# EAGLE design SparkFun_LilyPad-Switched-Battery (EAGLE 9.6.2)
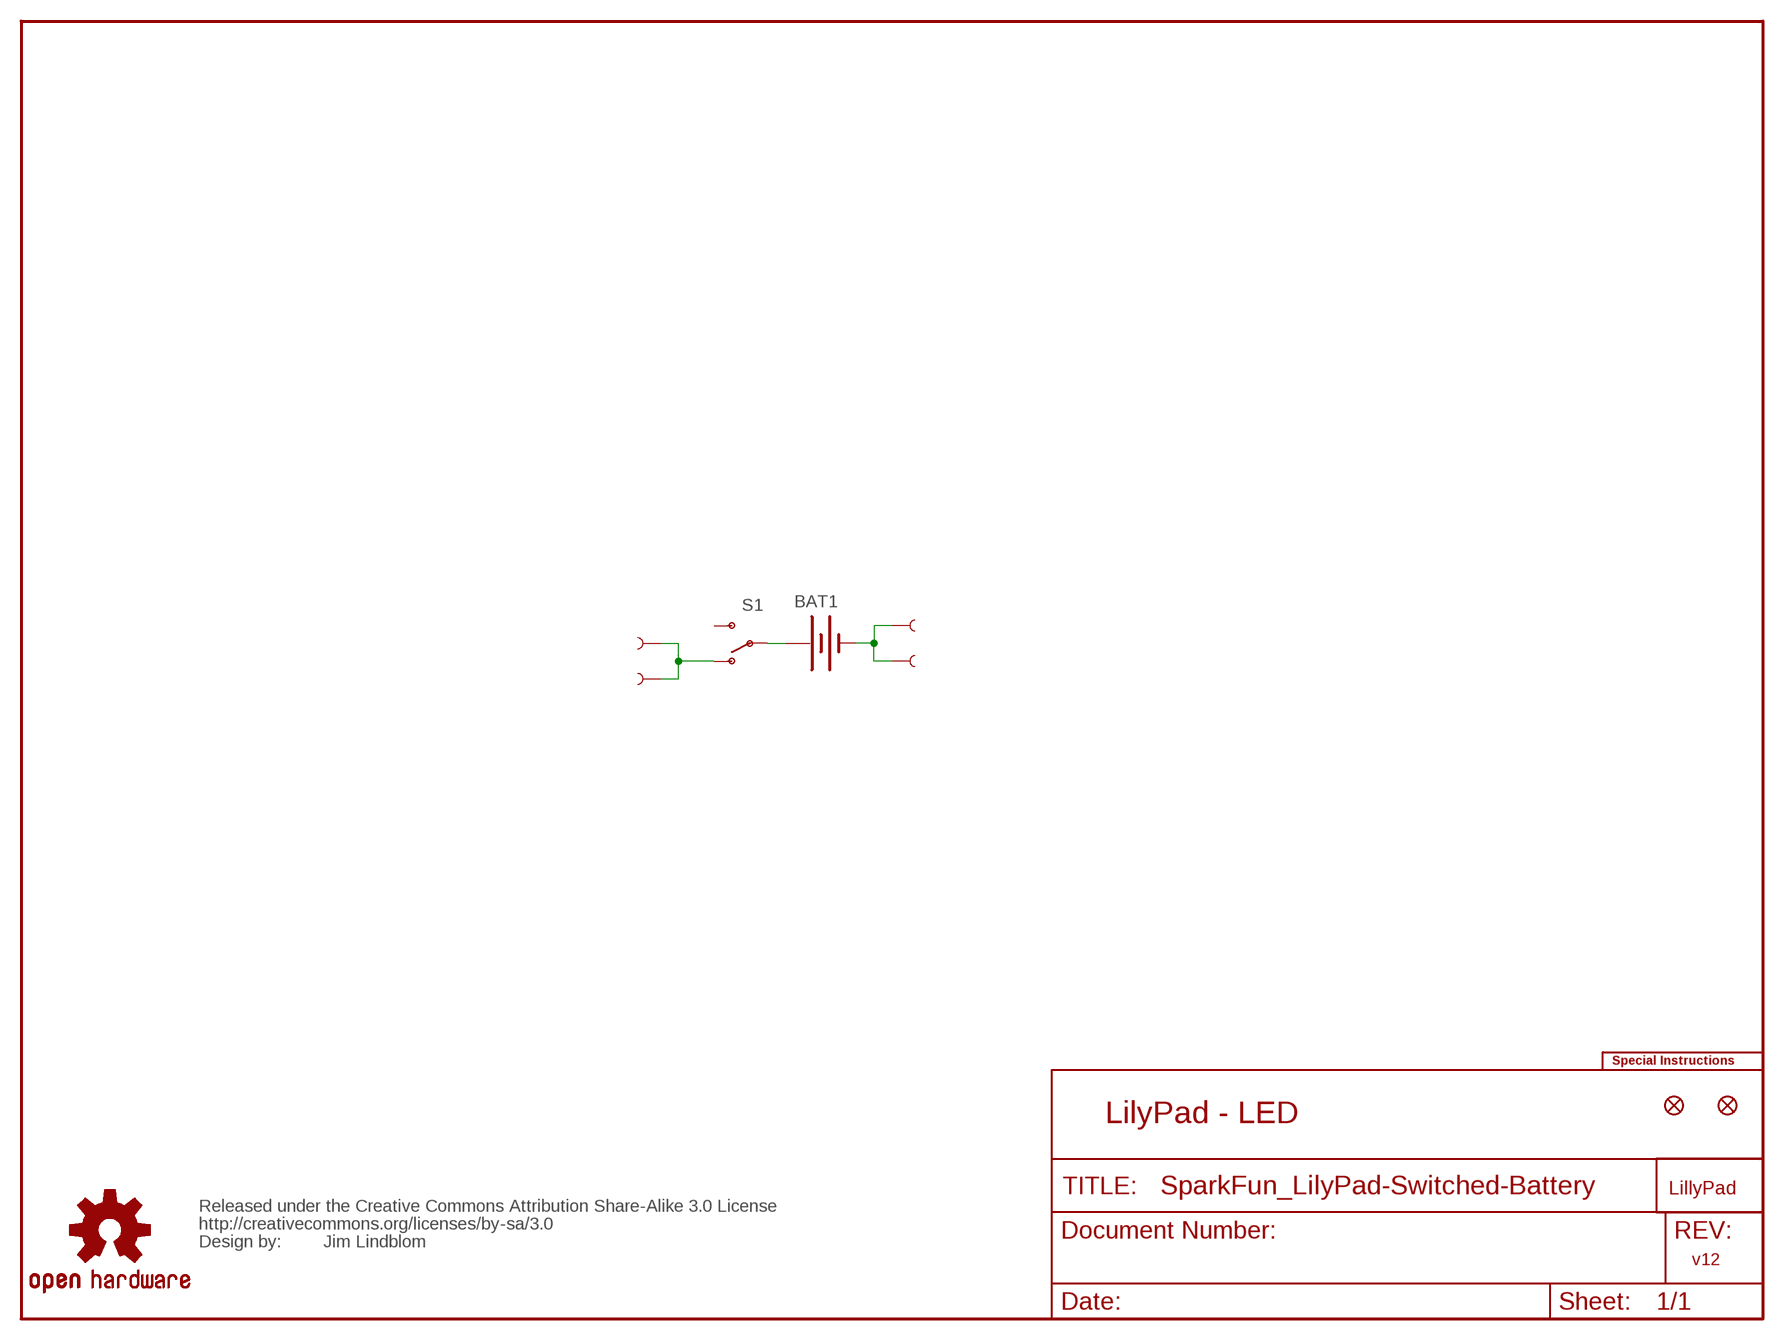
[diagram p0: schematic, sheet 1]

## Parts
BAT1  BATTERY20MM_4LEGS  [BATTCON_20MM_4LEGS]
JP1  FIDUCIALUFIDUCIAL  [MICRO-FIDUCIAL]
JP2  FIDUCIALUFIDUCIAL  [MICRO-FIDUCIAL]
LOGO1  SPECIAL_INSTRUCTIONS-ORDERING  [ORDERING_INSTRUCTIONS]
S1  SWITCH-SPSTSMD  [AYZ0202]
U$1  SEWTAP6  [PETAL-SMALL-2SIDE]
U$2  SEWTAP6  [PETAL-SMALL-2SIDE]
U$3  SEWTAP6  [PETAL-SMALL-2SIDE]
U$4  SEWTAP6  [PETAL-SMALL-2SIDE]
U$5  LOGO-LPLP  [LOGO-LILYPAD]
U$7  OSHW-LOGOS  [OSHW-LOGO-S]
U$8  CREATIVE_COMMONS  [CREATIVE_COMMONS]

## Nets
N$1: S1.1(O) U$2.1 U$4.1
N$2: BAT1.2(-) U$1.1 U$3.1
N$3: BAT1.1(+) BAT1.3(+) BAT1.P$1(+) BAT1.P$2(+) S1.2(P)
Unconnected: S1.3(S)

## Notes on the sheet
- LilyPad - LED
- Jim Lindblom
- v12

## Library data of the parts
BAT1 = SparkFun-Electromechanical:BATTERY: Battery Holders Various common sizes : AA, AAA, 20mm coin cell and 12mm coin cell.
JP1 JP2 = SparkFun:FIDUCIAL: Fiducial Alignment Points Various fiducial points for machine vision alignment.
LOGO1 = SparkFun-Aesthetics:SPECIAL_INSTRUCTIONS: Special Ordering/Production Instructions Alert Symbol for special PCB ordering instructions or unique production process warnings. Ordering Instructions Production Instructions Types of information that should be added to box: Copper weight Soldermask color Silk color PCB thickness Number of layers PCB Standard: 1.6mm FR4 1 oz copper immersion silver plating red soldermask white silkscreen Types of information that should be added to box: Special wash requirements Depaneling instructions Humidification Glue curing Default text settings: 0.07 inch 9% ratio 50% line distance
S1 = SparkFun:SWITCH-SPST: SPST Switch Simple slide switch. Spark Fun Electronics SKU : COM-00102
U$1-U$4 = LilyPad-Wearables:SEWTAP
U$5 = LilyPad-Wearables:LOGO-LP
U$7 = SparkFun-Aesthetics:OSHW-LOGO: Open Source Hardware Logo This logo indicates the piece of hardware it is found on incorporates a OSHW license and/or adheres to the definition of open source hardware found here: http://freedomdefined.org/OSHW
U$8 = SparkFun-Aesthetics:CREATIVE_COMMONS: Creative Commons License summary

## Board
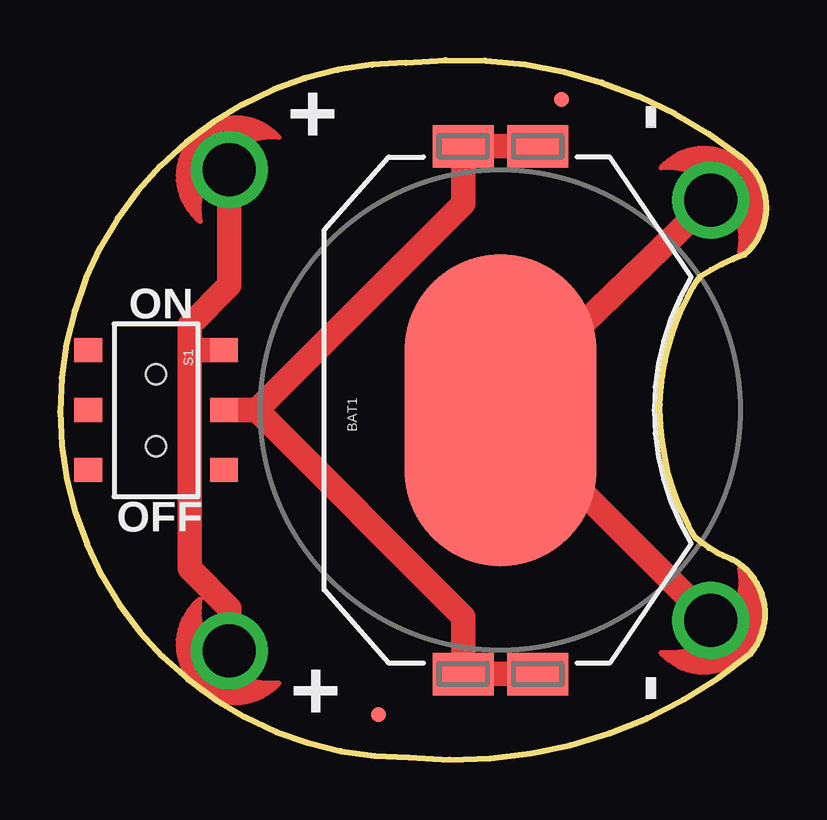
[diagram p1: board, top side]
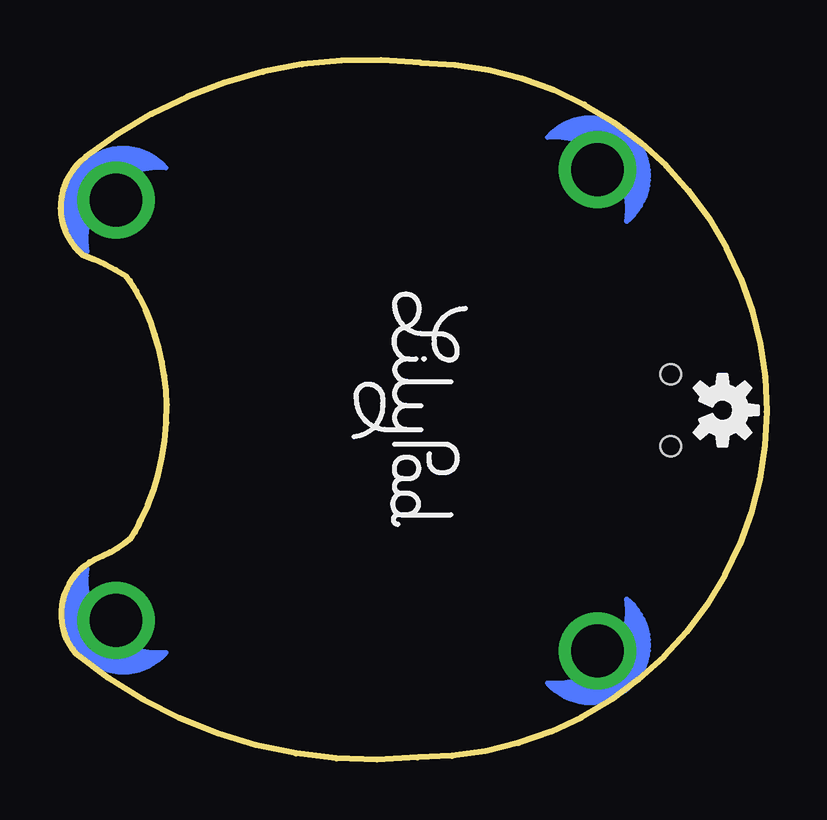
[diagram p2: board, bottom side, seen from below]

Size 29.42 x 29.17 mm. Coordinates in mm from the lower left corner, seen from the top.
Outline: 14.54,0.09 arc45 28.77,4.41 arc103 28,8.35 arc-20 26.48,9.25 arc-11 26.07,9.99 arc-17 25.21,12.55 arc-11 24.99,14.8 arc-13 25.34,17.17 arc-9 25.88,18.76 26.15,19.29 arc-14 26.7,20.16 arc-13 28.51,21.05 arc102 28.38,25.11 arc45 14.41,29.05 arc180 14.54,0.09
Copper layers (1*16): Top 0.035mm / dielectric 1.5mm / Bottom 0.035mm
Design rules "default": minimum track width 8mil, minimum drill 20mil, track to track 8mil, track to pad 8mil, pad to pad 8mil, via to via 8mil, smd to smd 8mil, copper to edge 8mil, drill to drill 8mil, minimum pad ring 12mil, minimum via ring 10mil, stop-mask expansion 4mil, vias tented up to drill 20mil, thermal gap 10mil

### Footprints (pad centres in the part's own frame; a part is rotated, then mirrored left to right if it is on the bottom)
BATTCON_20MM_4LEGS = smd 1.778 x 2.54: 1 -11,1.55; 3 11,1.55; P$1 -11,-1.55; P$2 11,-1.55 | smd 13 x 8: 2 0,0
MICRO-FIDUCIAL = smd 0.635 x 0.635: 1 0,0
AYZ0202 = smd 1 x 1.15: 1 -2.5,2.825; 2 0,2.825; 3 2.5,2.825; 4 -2.5,-2.825; 5 0,-2.825; 6 2.5,-2.825 | hole 0.85: 1.5,0; -1.5,0
PETAL-SMALL-2SIDE = drill 2.2: 1 0,0

### Placement (x,y rotation side)
BAT1  18.35,14.57 90 top
JP1  13.27,1.87 0 top
JP2  20.89,27.52 0 top
LOGO1  45.02,51.4 0 top  (outside the outline)
S1  4,14.57 270 top
U$1  27.11,5.81 47 top
U$2  7.05,4.54 313 top
U$3  27.11,23.33 133 top
U$4  7.05,24.6 227 top
U$5  14.54,14.57 270 bottom
U$7  1.84,14.57 270 bottom
U$8  43.75,-26.07 0 top  (outside the outline)

### Tracks (layer width: path | path; a pad name or v marks a point on that pad's centre or on a via)
N$1
  Top 1.016: U$4.1 7.05,19.78 5.4,18.13 5.4,17.11 | 5.4,17.11 5.4,7.97 7.05,6.32 U$2.1 | S1.1 5.44,17.07 5.4,17.11
N$2
  Top 1.016: 28,4.92 U$1.1 BAT1.2 18.35,14.82 U$3.1
N$3
  Top 1.016: S1.2 8.19,14.57 | 8.19,14.57 16.8,5.96 BAT1.1 BAT1.P$1 | BAT1.P$2 BAT1.3 16.8,23.18 8.19,14.57

### Text on the board
tPlace: - | + | ON | OFF | + | -
tDocu: Board Thickness is 0.8mm